# Altium schematic sheet Receiver.SchDoc: Receiver
size A4; Author: Andreas Rehn; CompanyName: Hochschule Ulm; Engineer: Andreas Rehn; Organization: Hochschule Ulm; Address1: Institut für Medizintechnik; Address2: und Mechatronik; Address3: Albert-Einstein-Allee 55; Address4: 89081 Ulm; SheetNumber: 5; SheetTotal: 11; ProjectName: Ultrasound Doppler 2015
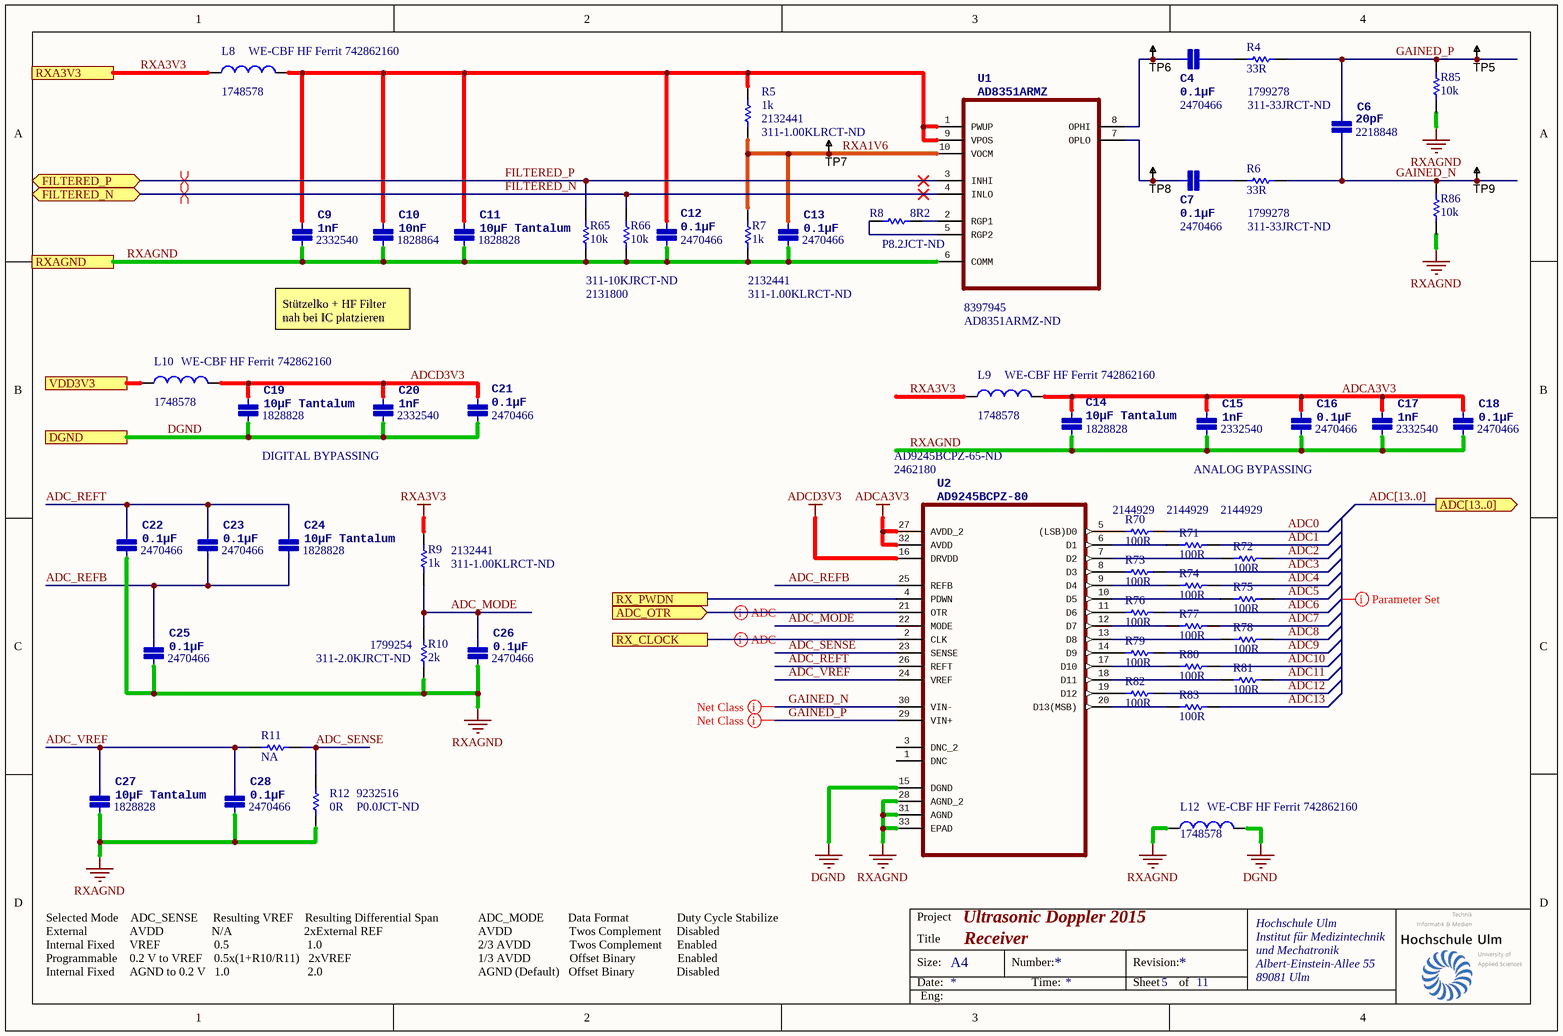
[diagram p0: Receiver.SchDoc]

## Parts
C4  0.1µF  Supplier Part Number 1: 2470466  [0402[1005]]
C6  20pF  Supplier Part Number 1: 2218848  [0402[1005]]
C7  0.1µF  Supplier Part Number 1: 2470466  [0402[1005]]
C9  1nF  Supplier Part Number 1: 2332540  [0402[1005]]
C10  10nF  Supplier Part Number 1: 1828864  [0402[1005]]
C11  10µF Tantalum  Supplier Part Number 1: 1828828  [0805[2012]]
C12  0.1µF  Supplier Part Number 1: 2470466  [0402[1005]]
C13  0.1µF  Supplier Part Number 1: 2470466  [0402[1005]]
C14  10µF Tantalum  Supplier Part Number 1: 1828828  [0805[2012]]
C15  1nF  Supplier Part Number 1: 2332540  [0402[1005]]
C16  0.1µF  Supplier Part Number 1: 2470466  [0402[1005]]
C17  1nF  Supplier Part Number 1: 2332540  [0402[1005]]
C18  0.1µF  Supplier Part Number 1: 2470466  [0402[1005]]
C19  10µF Tantalum  Supplier Part Number 1: 1828828  [0805[2012]]
C20  1nF  Supplier Part Number 1: 2332540  [0402[1005]]
C21  0.1µF  Supplier Part Number 1: 2470466  [0402[1005]]
C22  0.1µF  Supplier Part Number 1: 2470466  [0402[1005]]
C23  0.1µF  Supplier Part Number 1: 2470466  [0402[1005]]
C24  10µF Tantalum  Supplier Part Number 1: 1828828  [0805[2012]]
C25  0.1µF  Supplier Part Number 1: 2470466  [0402[1005]]
C26  0.1µF  Supplier Part Number 1: 2470466  [0402[1005]]
C27  10µF Tantalum  Supplier Part Number 1: 1828828  [0805[2012]]
C28  0.1µF  Supplier Part Number 1: 2470466  [0402[1005]]
L8  WE-CBF HF Ferrit 742862160  Supplier Part Number 1: 1748578  [0603[1508]]
L9  WE-CBF HF Ferrit 742862160  Supplier Part Number 1: 1748578  [0603[1508]]
L10  WE-CBF HF Ferrit 742862160  Supplier Part Number 1: 1748578  [0603[1508]]
L12  WE-CBF HF Ferrit 742862160  Supplier Part Number 1: 1748578  [0603[1508]]
R4  33R  Supplier Part Number 1: 311-33JRCT-ND  Supplier Part Number 2: 1799278  [0402[1005]]
R5  1k  Supplier Part Number 1: 311-1.00KLRCT-ND  Supplier Part Number 2: 2132441  [0402[1005]]
R6  33R  Supplier Part Number 1: 311-33JRCT-ND  Supplier Part Number 2: 1799278  [0402[1005]]
R7  1k  Supplier Part Number 1: 311-1.00KLRCT-ND  Supplier Part Number 2: 2132441  [0402[1005]]
R8  8R2  Supplier Part Number 1: P8.2JCT-ND  [0402[1005]]
R9  1k  Supplier Part Number 1: 311-1.00KLRCT-ND  Supplier Part Number 2: 2132441  [0402[1005]]
R10  2k  Supplier Part Number 1: 311-2.0KJRCT-ND  Supplier Part Number 2: 1799254  [0402[1005]]
R11  NA  [0402[1005]]
R12  0R  Supplier Part Number 1: P0.0JCT-ND  Supplier Part Number 2: 9232516  [0402[1005]]
R65  10k  Supplier Part Number 1: 311-10KJRCT-ND  Supplier Part Number 2: 2131800  [0402[1005]]
R66  10k  [0402[1005]]
R70  100R  Supplier Part Number 1: 2144929  [0402[1005]]
R71  100R  Supplier Part Number 1: 2144929  [0402[1005]]
R72  100R  Supplier Part Number 1: 2144929  [0402[1005]]
R73  100R  [0402[1005]]
R74  100R  [0402[1005]]
R75  100R  [0402[1005]]
R76  100R  [0402[1005]]
R77  100R  [0402[1005]]
R78  100R  [0402[1005]]
R79  100R  [0402[1005]]
R80  100R  [0402[1005]]
R81  100R  [0402[1005]]
R82  100R  [0402[1005]]
R83  100R  [0402[1005]]
R85  10k  [0402[1005]]
R86  10k  [0402[1005]]
TP5  TESTPOINT_THT_MINI  [TP-THT-MINI]  (value not drawn)
TP6  TESTPOINT_THT_MINI  [TP-THT-MINI]  (value not drawn)
TP7  TESTPOINT  [TP-R60]  (value not drawn)  (no BOM)
TP8  TESTPOINT_THT_MINI  [TP-THT-MINI]  (value not drawn)
TP9  TESTPOINT_THT_MINI  [TP-THT-MINI]  (value not drawn)
U1  AD8351ARMZ  Supplier Part Number 1: AD8351ARMZ-ND  Supplier Part Number 2: 8397945  [MSOP10]
U2  AD9245BCPZ-80  Supplier Part Number 1: 2462180  Supplier Part Number 2: AD9245BCPZ-65-ND  [LFCSP-32]

## Ports
ADC[13..0], ADC_OTR, DGND, FILTERED_N, FILTERED_P, RX_CLOCK, RX_PWDN, RXA3V3, RXAGND, VDD3V3

## Nets
ADCA3V3: C14.1(P$1) C15.1(P$1) C16.1(P$1) C17.1(P$1) C18.1(P$1) L9.2 U2.27(AVDD_2) U2.32(AVDD)
ADCD3V3: C19.1(P$1) C20.1(P$1) C21.1(P$1) L10.2 U2.16(DRVDD)
DGND: C19.2(P$2) C20.2(P$2) C21.2(P$2) L12.2 U2.15(DGND) ; port DGND
RXA3V3: L8.1 L9.1 R9.1 ; port RXA3V3
RXAGND: C9.2(P$2) C10.2(P$2) C11.2(P$2) C12.2(P$2) C13.2(P$2) C14.2(P$2) C15.2(P$2) C16.2(P$2) C17.2(P$2) C18.2(P$2) C22.2(P$2) C25.2(P$2) C26.2(P$2) C27.2(P$2) C28.2(P$2) L12.1 R7.2 R10.2 R12.2 R65.2 R66.2 R85.2 R86.2 U1.6(COMM) U2.28(AGND_2) U2.31(AGND) U2.33(EPAD) ; port RXAGND
ADC0: R70.2
ADC1: R71.2
ADC2: R72.2
ADC3: R73.2
ADC4: R74.2
ADC5: R75.2
ADC6: R76.2
ADC7: R77.2
ADC8: R78.2
ADC9: R79.2
ADC10: R80.2
ADC11: R81.2
ADC12: R82.2
ADC13: R83.2
ADC_MODE: C26.1(P$1) R9.2 R10.1 U2.22(MODE)
ADC_OTR: U2.21(OTR) ; port ADC_OTR
ADC_REFB: C23.2(P$2) C24.2(P$2) C25.1(P$1) U2.25(REFB)
ADC_REFT: C22.1(P$1) C23.1(P$1) C24.1(P$1) U2.26(REFT)
ADC_SENSE: R11.1 R12.1 U2.23(SENSE)
ADC_VREF: C27.1(P$1) C28.1(P$1) R11.2 U2.24(VREF)
FILTERED_N: R66.1 U1.4(INLO) ; port FILTERED_N
FILTERED_P: R65.1 U1.3(INHI) ; port FILTERED_P
GAINED_N: C6.2(P$2) R6.2 R86.1 TP9.1 U2.30(VIN-)
GAINED_P: C6.1(P$1) R4.2 R85.1 TP5.1 U2.29(VIN+)
RX_CLOCK: U2.2(CLK) ; port RX_CLOCK
RX_PWDN: U2.4(PDWN) ; port RX_PWDN
RXA1V6: C13.1(P$1) R5.2 R7.1 TP7.1 U1.10(VOCM)
VDD3V3: L10.1 ; port VDD3V3
NetC4_1: C4.1(P$1) TP6.1 U1.8(OPHI)
NetC4_2: C4.2(P$2) R4.1
NetC7_1: C7.1(P$1) TP8.1 U1.7(OPLO)
NetC7_2: C7.2(P$2) R6.1
NetC9_1: C9.1(P$1) C10.1(P$1) C11.1(P$1) C12.1(P$1) L8.2 R5.1 U1.1(PWUP) U1.9(VPOS)
NetR8_1: R8.1 U1.2(RGP1)
NetR8_2: R8.2 U1.5(RGP2)
NetR70_1: R70.1 U2.5((LSB)D0)
NetR71_1: R71.1 U2.6(D1)
NetR72_1: R72.1 U2.7(D2)
NetR73_1: R73.1 U2.8(D3)
NetR74_1: R74.1 U2.9(D4)
NetR75_1: R75.1 U2.10(D5)
NetR76_1: R76.1 U2.11(D6)
NetR77_1: R77.1 U2.12(D7)
NetR78_1: R78.1 U2.13(D8)
NetR79_1: R79.1 U2.14(D9)
NetR80_1: R80.1 U2.17(D10)
NetR81_1: R81.1 U2.18(D11)
NetR82_1: R82.1 U2.19(D12)
NetR83_1: R83.1 U2.20(D13(MSB))

Not connected (* = marked no-connect by the designer): U2 1(DNC) 3(DNC_2)

## Buses and harness runs
bus ADC[13..0] = port ADC[13..0]

## Layout directives
differential pair: FILTERED_N, FILTERED_P
net class ADC: ADC_OTR, RX_CLOCK
net class GAINED: GAINED_N, GAINED_P
rule Matched Net Lengths [Tolerance = 10mm]: (no net found under the mark)

## Notes on the sheet
- Stützelko + HF Filter
  nah bei IC platzieren
- DIGITAL BYPASSING
- ANALOG BYPASSING
- Selected Mode    ADC_SENSE     Resulting VREF    Resulting Differential Span
  External              AVDD                N/A                        2xExternal REF
  Internal Fixed     VREF                  0.5                          1.0
  Programmable    0.2 V to VREF    0.5x(1+R10/R11)   2xVREF
  Internal Fixed     AGND to 0.2 V   1.0                          2.0
- ADC_MODE        Data Format                Duty Cycle Stabilize
  AVDD                   Twos Complement     Disabled
  2/3 AVDD             Twos Complement     Enabled
  1/3 AVDD             Offset Binary              Enabled
  AGND (Default)   Offset Binary              Disabled
- Project
- Ultrasonic Doppler 2015
- Title
- Size:
- Date:
- A4
- Number:
- Time:
- Revision:
- Sheet
- of
- Eng:

## Library data of the parts
C4 C6 C7 C9-C28 = Capacitor: Cap; Supplier 1: Farnell
  C4 C7 C12 C13 C16 C18 C21-C23 C25 C26 C28: value: 0.1µF
  C6: value: 20pF
  C9 C15 C17 C20: value: 1nF
  C10: value: 10nF
  C11 C14 C19 C24 C27: value: 10µF Tantalum
L8-L10 L12 = Inductor: Code_IEC: 1005; Published: 8-Jun-2000; LatestRevisionDate: 29-May-2009; LatestRevisionNote: IPC-7351 Footprint Added.; PackageReference: 0402-A; Publisher: Altium Limited; PackageDescription: Chip Inductor; Code_JEITA: 0402; Value: WE-CBF HF Ferrit 742862160; Supplier 1: Farnell
R4-R12 R65 R66 R70-R83 R85 R86 = Resistor: Published: 8-Jun-2000; LatestRevisionDate: 17-Jul-2002; LatestRevisionNote: Re-released for DXP Platform.; PackageReference: AXIAL-0.3; Publisher: Altium Limited; PackageDescription: Axial Device, Thru-Hole; 2 Leads; 0.3 in Pin Spacing
  R4 R6: Value: 33R; Supplier 1: Digi-Key; Supplier 2: Farnell
  R5 R7 R9: Value: 1k; Supplier 1: Digi-Key; Supplier 2: Farnell
  R8: Value: 8R2; Supplier 1: Digi-Key
  R10: Value: 2k; Supplier 1: Digi-Key; Supplier 2: Farnell
  R11: Value: NA
  R12: Value: 0R; Supplier 1: Digi-Key; Supplier 2: Farnell
  R65: Value: 10k; Supplier 1: Digi-Key; Supplier 2: Farnell
  R66 R85 R86: Value: 10k; Supplier 1: Digi-Key; Supplier Part Number 1: 311-10KJRCT-ND; Supplier 2: Farnell; Supplier Part Number 2: 2131800
  R70-R72: Value: 100R; Supplier 1: Farnell
  R73-R83: Value: 100R; Supplier 1: Farnell; Supplier Part Number 1: 2144929
TP5 TP6 TP8 TP9 = TESTPOINT_THT_MINI: Test Point PCB mount Miniature White; PBL Part Number: 3100-567; Manufacturer 1: Keystone Electronics; Manufacturer Part Number 1: 5002; Mounting Type: 0.040" (1.0mm) Hole Diameter; Material: Base, Nylon 46, UL 94V-0; Supplier 1: Digi-Key; Supplier Part Number 1: 5002K-ND
TP7 = TESTPOINT: SMD test pin
U1 = AD8351ARMZ: Differential RF/IF Amplifier; OC_FARNELL: 8397945; OC_NEWARK: 19M0954; PACKAGE: MSOP-10; SUPPLIER: Analog Devices; Supplier 1: Digi-Key; MPN: AD8351ARMZ; ComponentLink1URL: http://www.farnell.com/datasheets/1887447.pdf; value: AD8351ARMZ; ComponentLink1Description: DataSheet; Supplier 2: Farnell
U2 = AD9245BCPZ-80: DIFF 14-Bit ADC; MPN: AD9245BCPZ-80; OC_FARNELL: 2096172; OC_NEWARK: 59K7235; PACKAGE: QFN-32; SUPPLIER: ANALOG DEVICES; ComponentLink1URL: http://www.farnell.com/datasheets/1759742.pdf; value: AD9245BCPZ-80; ComponentLink1Description: DataSheet; Supplier 1: Farnell; Supplier 2: Digi-Key